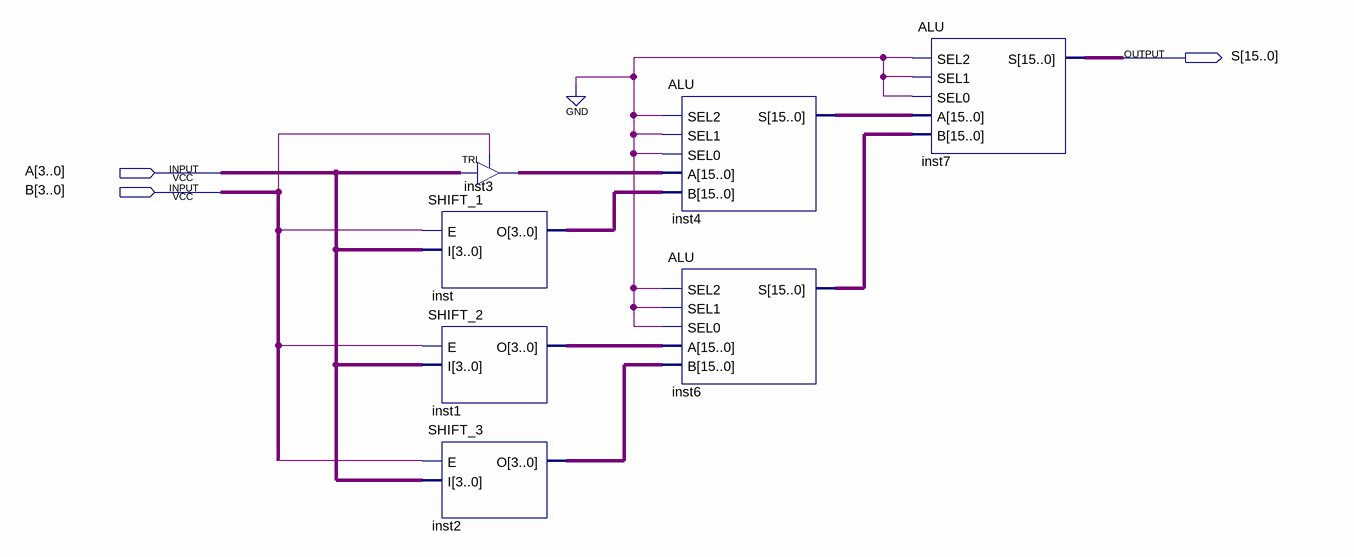
[diagram p0: schematic sheet]
// Quartus schematic NHAN4BIT.bdf as structural Verilog: 7 symbols, 3 pins
module NHAN4BIT (
  input  [3:0] A,
  input  [3:0] B,
  output [15:0] S
);

  wire undriven, undriven_2, undriven_3, undriven_4;
  wire [15:0] inst1_o, inst2_o, inst3_out, inst4_s, inst6_s, inst_o;

  SHIFT_1 inst (.E(undriven_3), .I(A), .O(inst_o));
  SHIFT_2 inst1 (.E(undriven_2), .I(A), .O(inst1_o));
  SHIFT_3 inst2 (.E(undriven), .I(A), .O(inst2_o));
  TRI inst3[15:0] (.IN(A), .OE(undriven_4), .OUT(inst3_out));
  ALU inst4 (.SEL2(1'b0), .SEL1(1'b0), .SEL0(1'b0), .A(inst3_out), .B(inst_o), .S(inst4_s));
  ALU inst6 (.SEL2(1'b0), .SEL1(1'b0), .SEL0(1'b0), .A(inst1_o), .B(inst2_o), .S(inst6_s));
  ALU inst7 (.SEL2(1'b0), .SEL1(1'b0), .SEL0(1'b0), .A(inst4_s), .B(inst6_s), .S(S));
endmodule
